# EAGLE schematic cyborg_ring_v0 (EAGLE 7.7.0)
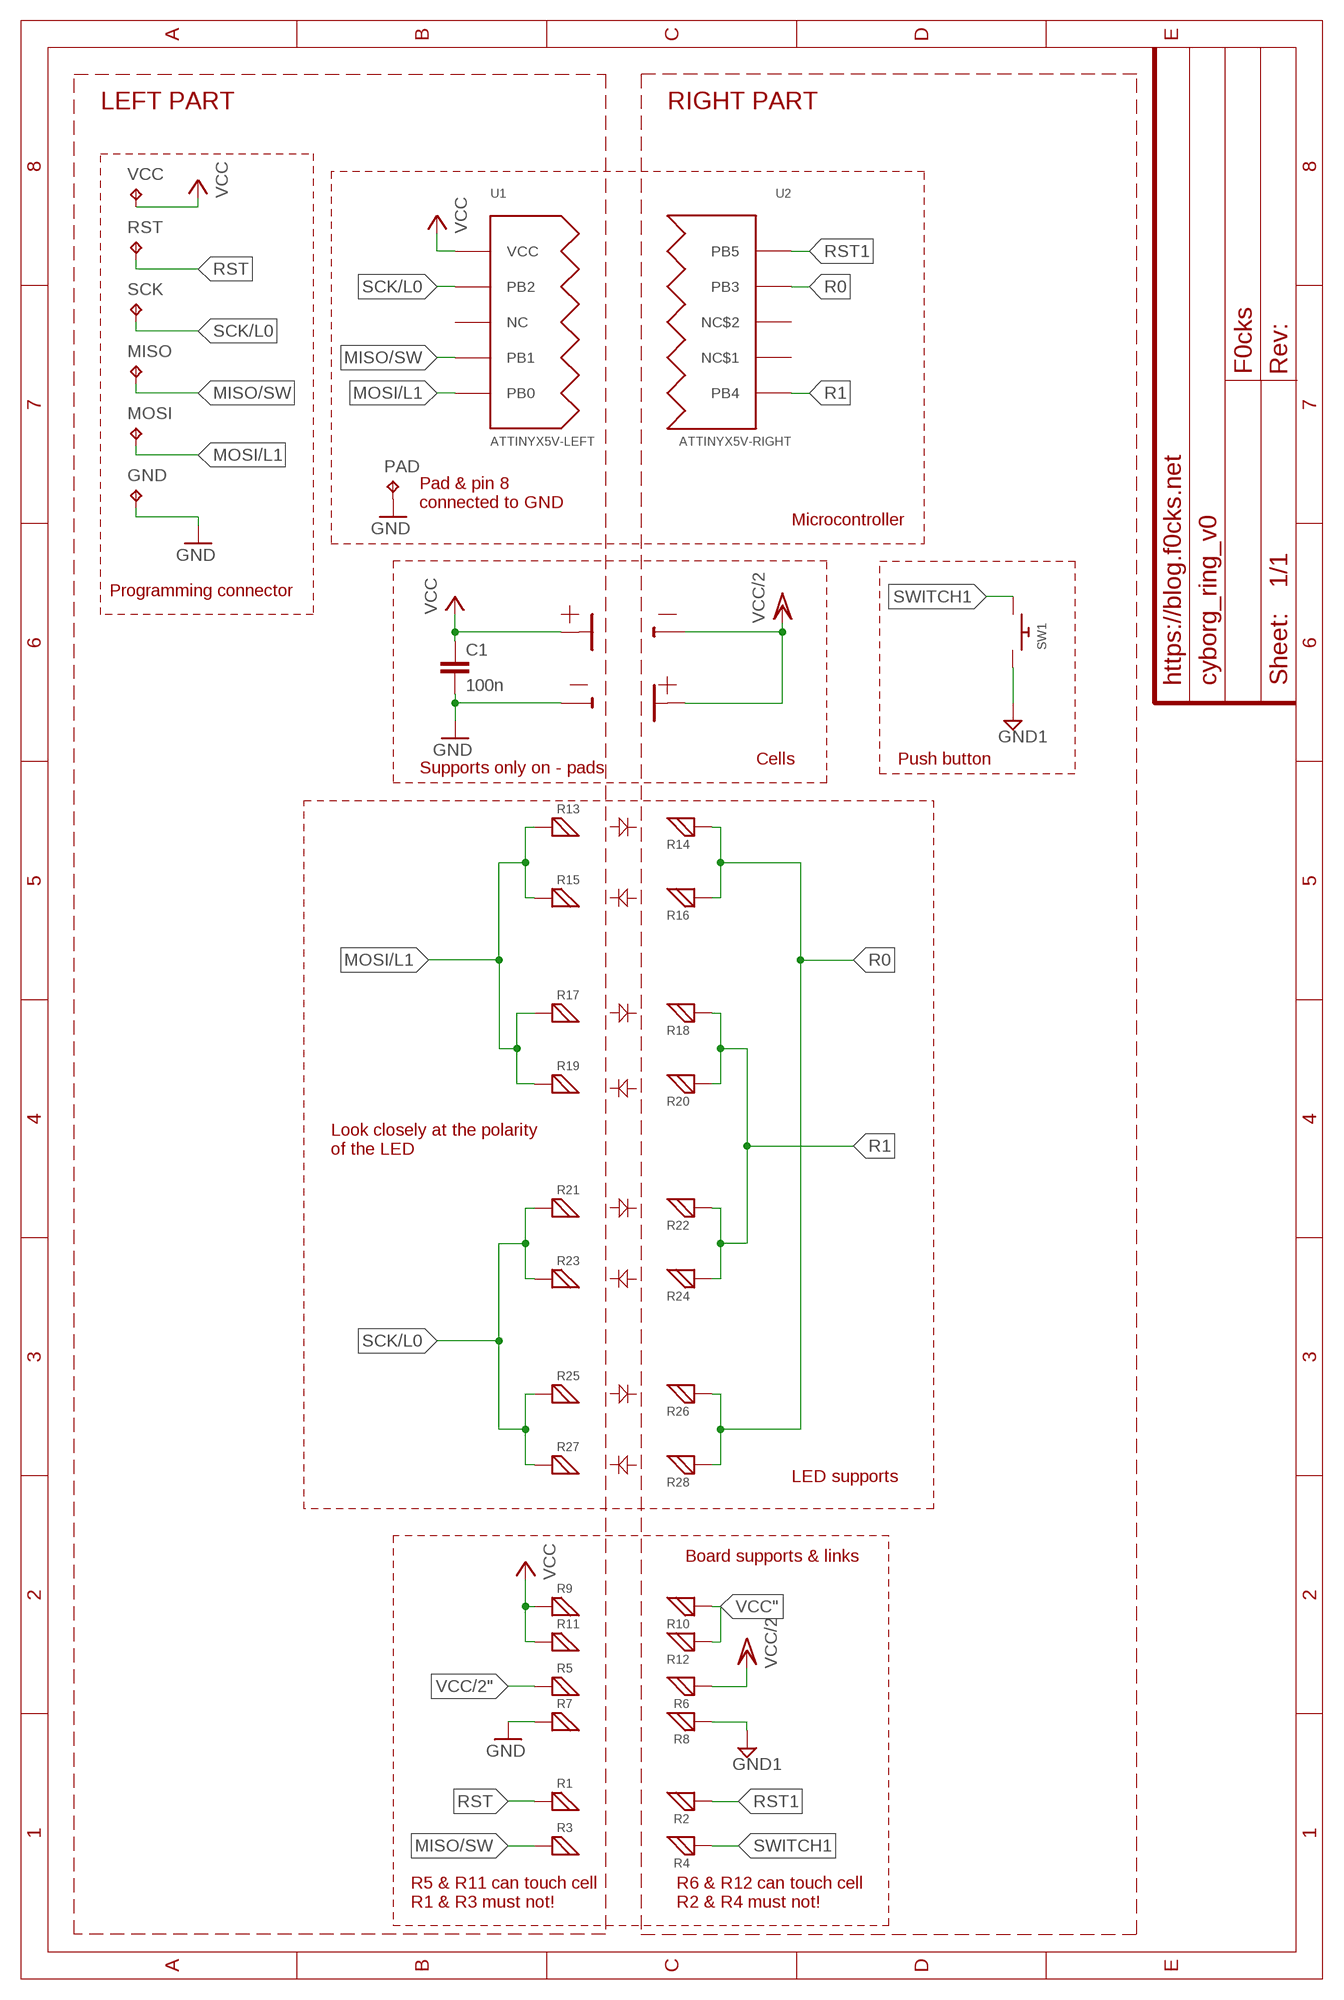
[diagram p0: schematic, sheet 1]

## Parts
C1  100n  C-EUC0201  [C0201]
GND  TPTP15R  [TP15R]
MISO  TPTP15R  [TP15R]
MOSI  TPTP15R  [TP15R]
PAD  TPTP06R  [TP06R]
R1  R0805-1/2TEST  [R0805-1/2]
R2  R0805-1/2TEST  [R0805-1/2]
R3  R0805-1/2TEST  [R0805-1/2]
R4  R0805-1/2TEST  [R0805-1/2]
R5  R0805-1/2TEST2  [R0905-1/2BIS]
R6  R0805-1/2TEST2  [R0905-1/2BIS]
R7  R0805-1/2TEST  [R0805-1/2]
R8  R0805-1/2TEST  [R0805-1/2]
R9  R0805-1/2TEST  [R0805-1/2]
R10  R0805-1/2TEST  [R0805-1/2]
R11  R0805-1/2TEST2  [R0905-1/2BIS]
R12  R0805-1/2TEST2  [R0905-1/2BIS]
R13  R0508-1/2  [R0508-1/2]
R14  R0508-1/2  [R0508-1/2]
R15  R0508-1/2  [R0508-1/2]
R16  R0508-1/2  [R0508-1/2]
R17  R0508-1/2  [R0508-1/2]
R18  R0508-1/2  [R0508-1/2]
R19  R0508-1/2  [R0508-1/2]
R20  R0508-1/2  [R0508-1/2]
R21  R0508-1/2  [R0508-1/2]
R22  R0508-1/2  [R0508-1/2]
R23  R0508-1/2  [R0508-1/2]
R24  R0508-1/2  [R0508-1/2]
R25  R0508-1/2  [R0508-1/2]
R26  R0508-1/2  [R0508-1/2]
R27  R0508-1/2  [R0508-1/2]
R28  R0508-1/2  [R0508-1/2]
RST  TPTP15R  [TP15R]
SCK  TPTP15R  [TP15R]
SW1  SWITCH_PUSHBUTTONC&K_KSS  [BTN_CK_KSS]
U1  ATTINYX5V-LEFT  [1/4-QFN20]
U2  ATTINYX5V-RIGHT  [1/4-QFN20]
U$1  BAT+  [BAT+]
U$2  BAT+  [BAT+]
U$3  BAT-  [BAT-]
U$4  BAT-  [BAT-]
VCC  TPTP15R  [TP15R]

## Nets
GND: C1.2 GND.TP PAD.TP R7.1 U$4.P$1(-)
GND1: R8.1 SW1.P$1
MISO/SW: MISO.TP R3.1 U1.4(PB1)
MOSI/L1: MOSI.TP R13.P$1 R15.P$1 R17.P$1 R19.P$1 U1.5(PB0)
R0: R14.P$1 R16.P$1 R26.P$1 R28.P$1 U2.4(PB3)
R1: R18.P$1 R20.P$1 R22.P$1 R24.P$1 U2.1(PB4)
RST: R1.1 RST.TP
RST1: R2.1 U2.5(PB5)
SCK/L0: R21.P$1 R23.P$1 R25.P$1 R27.P$1 SCK.TP U1.2(PB2)
SWITCH1: R4.1 SW1.P$2
VCC: C1.1 R9.1 R11.1 U1.1(VCC) U$1.P$1(+) VCC.TP
VCC": R10.1 R12.1
VCC/2: R6.1 U$2.P$1(+) U$3.P$1(-)
VCC/2": R5.1
Unconnected: U1.3(NC) U2.2(NC$1) U2.3(NC$2)

## Notes on the sheet
- LEFT PART | RIGHT PART
- Pad & pin 8
  connected to GND
- Microcontroller
- Programming connector
- Cells | Push button
- Supports only on - pads
- Look closely at the polarity 
  of the LED
- LED supports
- Board supports & links
- R5 & R11 can touch cell
  R1 & R3 must not!
- R6 & R12 can touch cell
  R2 & R4 must not!

## Library data of the parts
C1 = rcl:C-EU: CAPACITOR, European symbol
GND MISO MOSI PAD RST SCK VCC = testpad:TP: Test pad
R1-R12 = cyborg_ring:R0805-1/2
R13-R28 = cyborg_ring:R0508-1/2
SW1 = cyborg_ring:SWITCH_PUSHBUTTON: Buttons SOFTTOUCHSMD_SJ - Soft touch temporary push button (Super Junk Akihabara) Compatible with SKPMANE010 [Mouser: 688-SKPMAN] C&K_KSS = Digikey: KSS221GLFS
U1 = cyborg_ring:ATTINYX5V-LEFT
U2 = cyborg_ring:ATTINYX5V-RIGHT
U$1 U$2 = cyborg_ring:BAT+
U$3 U$4 = cyborg_ring:BAT-